# Altium schematic sheet Power.SchDoc: Power Supply
size B; Date: 7/29/2023; Revision: 00; SheetNumber: 2; SheetTotal: 5
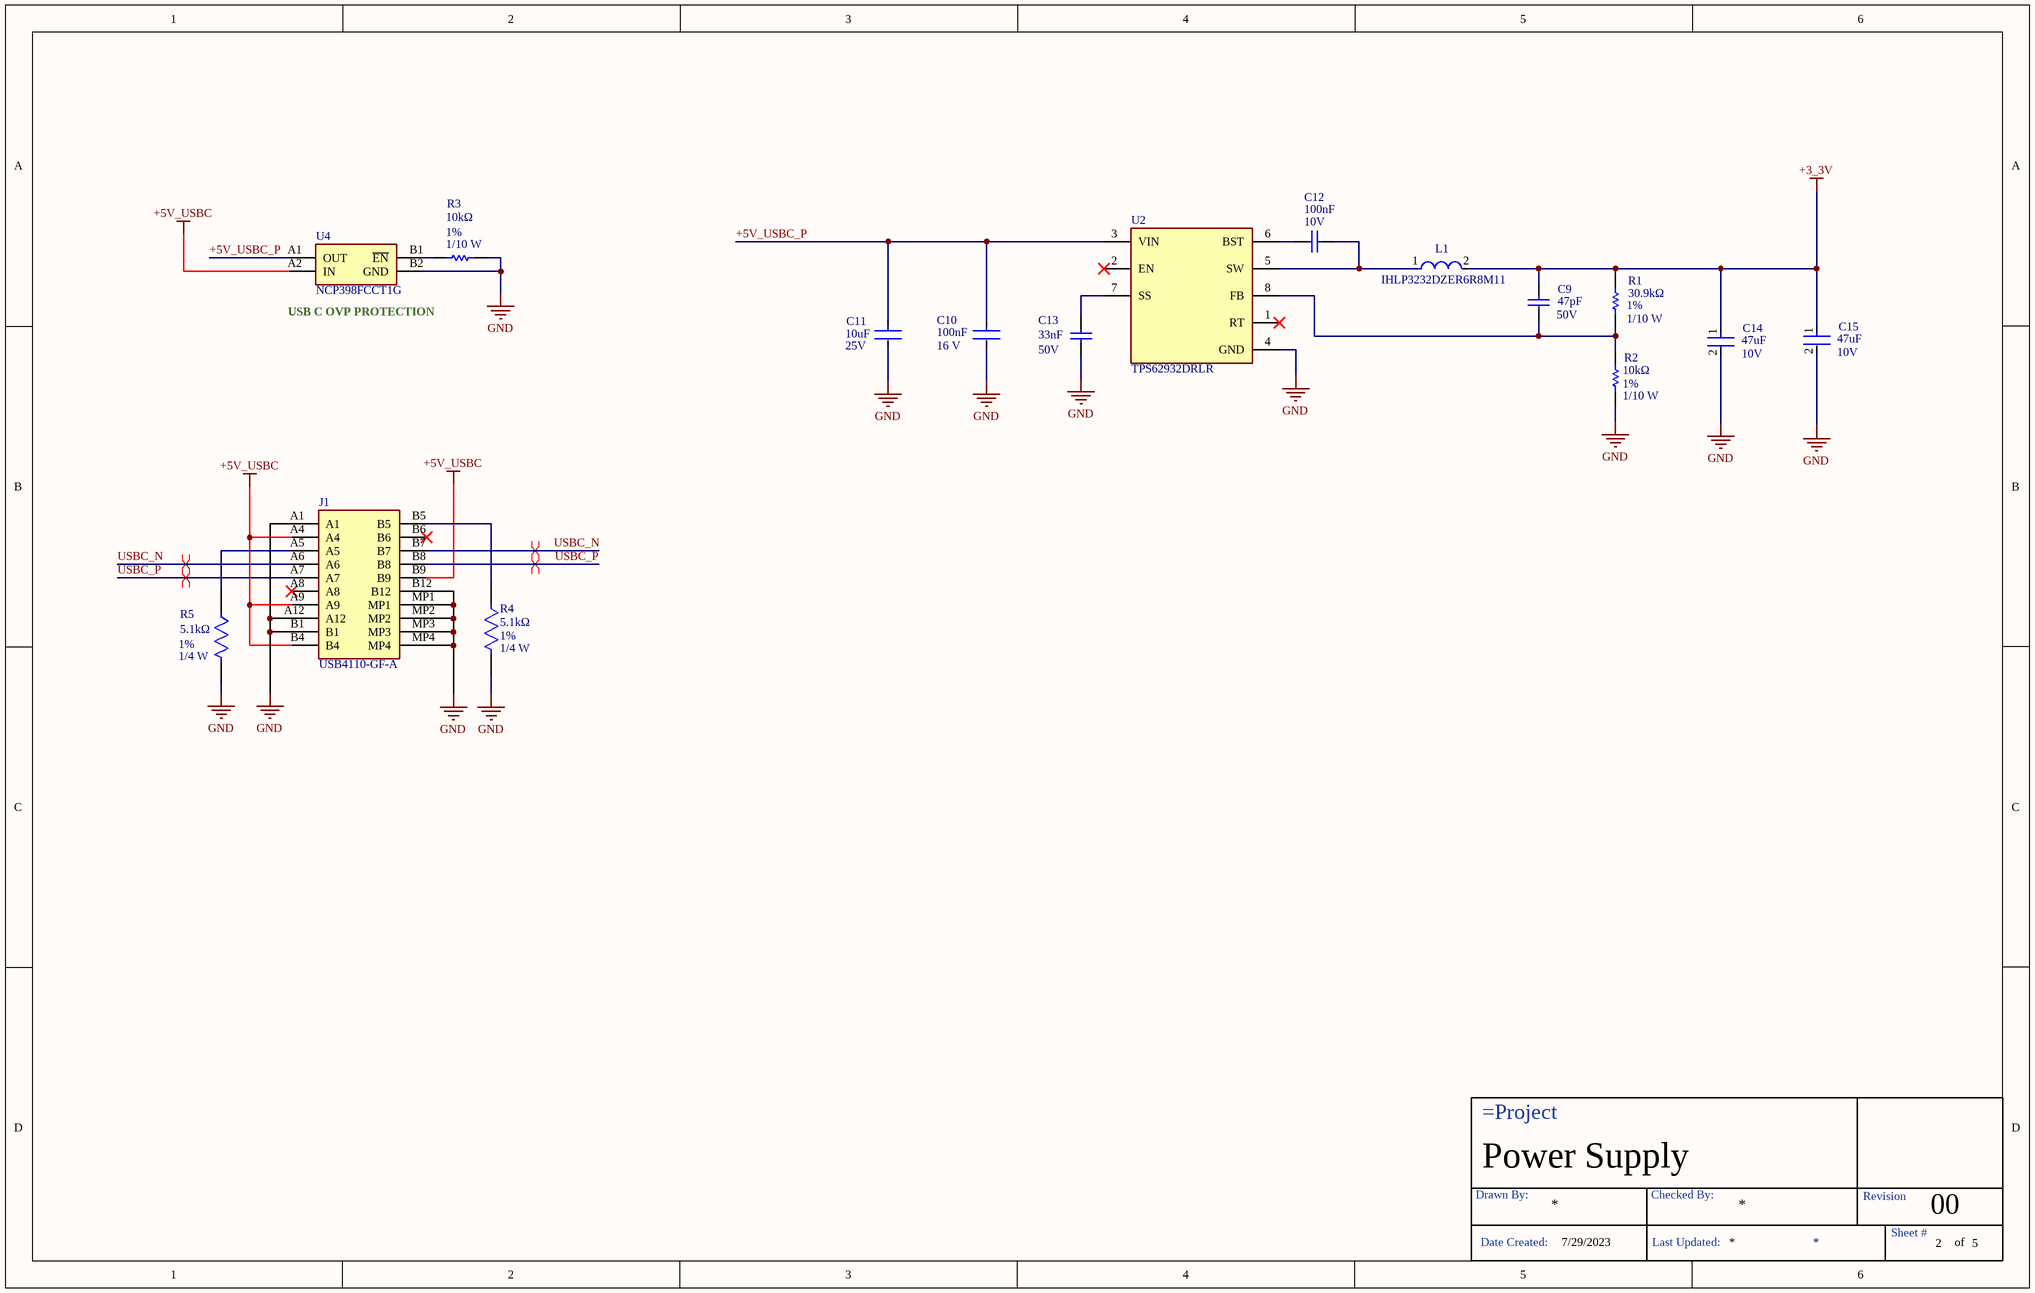
[diagram p0: Power.SchDoc]

## Parts
?  Title Block  (value not drawn)
C9  Capacitance: 47pF  Voltage Rating: 50V  [CAPC1608X90X35LL10T15]  (hidden comment: GQM1885C1H470JB01D)
C10  Capacitance: 100nF  Voltage Rating: 16 V  [FP-C0603C-CF-MFG]  (hidden comment: C0603C104K4RACTU)
C11  Voltage Rating: 25V  Capacitance: 10uF  [FP-C1608-080-IPC_A]  (hidden comment: C1608X5R1E106M080AC)
C12  Rated Voltage: 10V  Capacitance: 100nF  [CAPC1005X55X25LL05T10]  (hidden comment: GRM155R71A104KA01D)
C13  Capacitance: 33nF  Voltage Rating: 50V  [CAPC1608X90X35NL10T15]  (hidden comment: GRM188R71H333KA61D)
C14  Capacitance: 47uF  Voltage Rating: 10V  [FP-C2012-125-0_2-IPC_B]  (hidden comment: C2012X5R1A476M125AC)
C15  Capacitance: 47uF  Voltage Rating: 10V  [FP-C2012-125-0_2-IPC_B]  (hidden comment: C2012X5R1A476M125AC)
J1  USB4110-GF-A  [USB4110GFA]
L1  IHLP3232DZER6R8M11  [FP-IHLP-3232DZ-FP_2_413x5-MFG]
R1  Resistance: 30.9kΩ  Tolerance: 1%  Power Rating: 1/10 W  [RESC1609X50X30LL10T20]  (hidden comment: CRCW060330K9FKEA)
R2  Resistance: 10kΩ  Tolerance: 1%  Power Rating: 1/10 W  [RESC1609X50X30NL8T20]  (hidden comment: CRCW060310K0FKEA)
R3  Resistance: 10kΩ  Tolerance: 1%  Power Rating: 1/10 W  [RESC1609X50X30NL8T20]  (hidden comment: CRCW060310K0FKEA)
R4  Tolerance: 1%  Max Power Dissipation: 1/4 W  Resistance: 5.1kΩ  [FP-CRCW0603-HPe3-MFG]  (hidden comment: CRCW06035K10FKEAHP)
R5  Tolerance: 1%  Max Power Dissipation: 1/4 W  Resistance: 5.1kΩ  [FP-CRCW0603-HPe3-MFG]  (hidden comment: CRCW06035K10FKEAHP)
U2  TPS62932DRLR  [FP-DRL0008A-MFG]
U4  NCP398FCCT1G  [BGA4C40P2X2_84X84X60]

## Nets
+3_3V: C9.2 C14.1 C15.1 L1.2 R1.2
+5V_USBC: J1.A4 J1.A9 J1.B4 J1.B9 U4.A2(IN)
GND: C10.2 C11.2 C13.1 C14.2 C15.2 J1.A1 J1.A12 J1.B1 J1.B12 J1.MP1 J1.MP2 J1.MP3 J1.MP4 R2.1 R3.1 R4.2 R5.2 U2.4(GND) U4.B2(GND)
+5V_USBC_P: C10.1 C11.1 U2.3(VIN) U4.A1(OUT)
USBC_N: J1.A6 J1.B7
USBC_P: J1.A7 J1.B8
NetC9_1: C9.1 R1.1 R2.2 U2.8(FB)
NetC12_1: C12.1 U2.6(BST)
NetC12_2: C12.2 L1.1 U2.5(SW)
NetC13_2: C13.2 U2.7(SS)
NetJ1_A5: J1.A5 R5.1
NetJ1_B5: J1.B5 R4.1
NetR3_2: R3.2 U4.B1(~{EN})

Not connected (* = marked no-connect by the designer): J1 A8* B6*; U2 1(RT)* 2(EN)*

## Layout directives
differential pair: USBC_N, USBC_P

## Notes on the sheet
- (near U4) USB C OVP PROTECTION
- (in symbol Title Block) Drawn By:; Checked By:; Revision; Sheet #; Date Created:; Last Updated:; of

## Library data of the parts
C9 = CMP-2006-02430-1: Manufacturer: Murata; Part Number: GQM1885C1H470JB01D
C10 = CMP-2006-03811-3: Capacitor; Ceramic; Cap; .100uF; Tol 10%; SMT; Vol-Rtg 16V; X7R; Tape and Reel; Manufacturer: KEMET; Value: 0.10 μF; Temperature Coefficient: 30ppm/°C; Automotive Grade: Grade 1; Tolerance: 0.1; Digikey Description: Capacitor; Ceramic; Cap; .100uF; Tol 10%; SMT; Vol-Rtg 16V; X7R; Tape and Reel; Automotive: Yes; Temperature Range High: +125°C; Device Class L1: Passive Components; Material: Ceramic; Lead Free: Yes; Device Class L2: Capacitors; Height: 0.87mm; Manufacturer Part Number: C0603C104K4RACTU; Octopart: https://octopart.com/c0603c104k4ractu-kemet-93067; Package: C0603C-CF; Temperature Characteristic: X7R; Device Class L3: Ceramic Capacitors; ComponentLink2URL: https://api.kemet.com/component-edge/download/datasheet/C0603C100J5GACAUTO.pdf; Temperature Range Low: -55°C; ComponentLink2Description: Datasheet; Mouser Description: Multilayer Ceramic Capacitors MLCC - SMD/SMT 16volts 0.1uF 10% X7R 10%; RoHS: TRUE; Temperature: -55°C to +125°C; Category: Cap
C11 = CMP-2000-05442-2: CAP CER 10UF 25V X5R 0603; Dielectric Material: Ceramic; Tolerance: 20%; Dielectric: X5R; Length: 1.6mm; Termination: SMD/SMT; Depth: 0.8mm; RoHS Compliant: Yes; Construction: Flat; Weight: 7.1E-05oz; Thickness: 0.039inch; Packaging: Tape and Reel; Min Operating Temperature: -55°C; Case Code (Imperial): 0603; Case/Package: 0603; Height: 0.8mm; Case Code (Metric): 1608; Resistor Type: Ceramic; Voltage Rating (DC): 25V; Max Operating Temperature: 85°C; REACH SVHC: No SVHC; Lead Free: Lead Free; Series: C; Width: 0.8mm; Mount: Surface Mount; Package Quantity: 1
C12 = CMP-2000-06331-1: Chip Capacitor, 0.1 uF, +/- 10%, 10 V, -55 to 125 degC, 0402 (1005 Metric), RoHS, Tape and Reel; Manufacturer: Murata; Dielectric: X7R; Manufacturer URL: http://www.murata.com/; Datasheet Version: 02/2016; Datasheet URL: http://search.murata.co.jp/Ceramy/image/img/A01X/G101/ENG/GRM155R71A104KA01-01.pdf; Package Reference: 0402; Tolerance (%): ±10%; Package Description: 2-Pin Surface Mount Device, Body 1 x 0.5 mm; Mounting Technology: SurfaceMount; Case Size/Dimension: 0402
C13 = CMP-2006-02918-1: Manufacturer: Murata; Part Number: GRM188R71H333KA61D
C14 C15 = CMP-2000-05451-2: Multilayer Ceramic Capacitors 47μF ±20% 10V X5R SMD 0805; RoHS Compliant: Yes; Dielectric: X5R; Case Code (Imperial): 0805; Min Operating Temperature: -55°C; Length: 2mm; Lead Free: Lead Free; Weight: 0.000194oz; Resistor Type: Ceramic; Dielectric Material: Ceramic; Max Operating Temperature: 85°C; Height: 1.25mm; Width: 0.049inch; Depth: 1.25mm; Termination: SMD/SMT; Case/Package: 0805; Voltage Rating (DC): 10V; Voltage: 10V; Thickness: 0.057inch; Tolerance: 20%; REACH SVHC: No SVHC; Package Quantity: 1; Series: C; Case Code (Metric): 2012; Mount: Surface Mount; Packaging: Tape and Reel
J1 = USB4110-GF-A: Connector; Manufacturer_Name: GCT (GLOBAL CONNECTOR TECHNOLOGY); Datasheet Link: https://gct.co/files/drawings/usb4110.pdf; Height: 3.26mm; Manufacturer_Part_Number: USB4110-GF-A
L1 = CMP-02424-000226-1: Commercial Inductors, Low DCR Series 6.8uH 7A 33.4mΩ 20%; Test Frequency: 100kHz; Max DC Current: 6.7A; Core Material: Ferrite; DC Resistance (DCR): 33.4mR; Self Resonant Frequency: 13MHz; Shielding: Shielded; Lead Free: Lead Free; Min Operating Temperature: -55°C; Max Operating Temperature: 125°C; Military Standard: Not; Number of Pins: 2; Length: 0.34inch; Width: 8.18mm; Height - Seated (Max): 0.157inch; Depth: 8.26mm; Package Quantity: 500; Packaging: Tape and Reel; Inductance Tolerance: 20%; Saturation Current: 6.7A; Tolerance: 20%; Mount: Surface Mount; RMS Current (Irms): 7A; Termination: SMD/SMT; Current Rating: 7A; Height: 4mm; Case/Package: 3232; Radiation Hardening: No; Inductance: 6.8uH
R1 = CMP-2000-03227-1: Manufacturer: Vishay Dale; Part Number: CRCW060330K9FKEA
R2 R3 = CMP-1666-00005-4: Chip Resistor, 10 KOhm, +/- 1%, 100 mW, -55 to 155 degC, 0603 (1608 Metric), RoHS, Tape and Reel; Manufacturer: Vishay Semiconductor; Voltage Rating: 75 V; Max Operating Temperature: 155 degC; PackageDescription: 2-Pin Surface Mount Device, Body 1.575 x 0.85 mm; ComponentLink1Description: Manufacturer URL; RoHSCompliant: true; PackageReference: 0603; REACH SVHC: Unknown; Length: 1.55 mm; DatasheetVersion: 06/2012; Packaging: Tape and Reel; Min Operating Temperature: -55 degC; Mounting Technology: Surface Mount; ComponentLink2URL: https://datasheet.ciiva.com/11809/0900766b80d98afc-11809037.pdf; Height: 0.45 mm; ComponentLink2Description: Datasheet; Package Quantity: 5000; ComponentLink1URL: http://www.vishay.com/
R4 R5 = CMP-02407-006055-1: RES Thick Film, 5.1kΩ, 1%, 0.33W, 100ppm/°C, 0603; Power Rating: 250mW; Width: 0.033inch; Mount: Surface Mount; Number of Terminations: 2; Depth: 0.85mm; Case Code (Metric): 1608; Height: 0.022inch; Features: Automotive AEC-Q200; Military Standard: Not; Max Operating Temperature: 155°C; Contact Plating: Tin; Packaging: Tape and Reel; Temperature Coefficient: 100ppm/°C; Case/Package: 0603; Composition: Thick Film; Min Operating Temperature: -55°C; Length: 1.6mm; Radiation Hardening: No; Case Code (Imperial): 0603; Lead Free: Lead Free; Package Quantity: 5000
U2 = CMP-04918-000714-1: 3.8-V TO 30-V INPUT, 2-A, 200-KH
U4 = NCP398FCCT1G: Integrated Circuit; Manufacturer_Name: onsemi; Datasheet Link: https://www.onsemi.com/pub/Collateral/NCP398-D.PDF; Height: 0.6mm; Manufacturer_Part_Number: NCP398FCCT1G; Mouser Part Number: 863-NCP398FCCT1G; Mouser Price/Stock: https://www.mouser.co.uk/ProductDetail/onsemi/NCP398FCCT1G?qs=8hV9pjh0QhMpkPl4ZTT5TA%3D%3D; Arrow Part Number: NCP398FCCT1G; Arrow Price/Stock: https://www.arrow.com/en/products/ncp398fcct1g/on-semiconductor